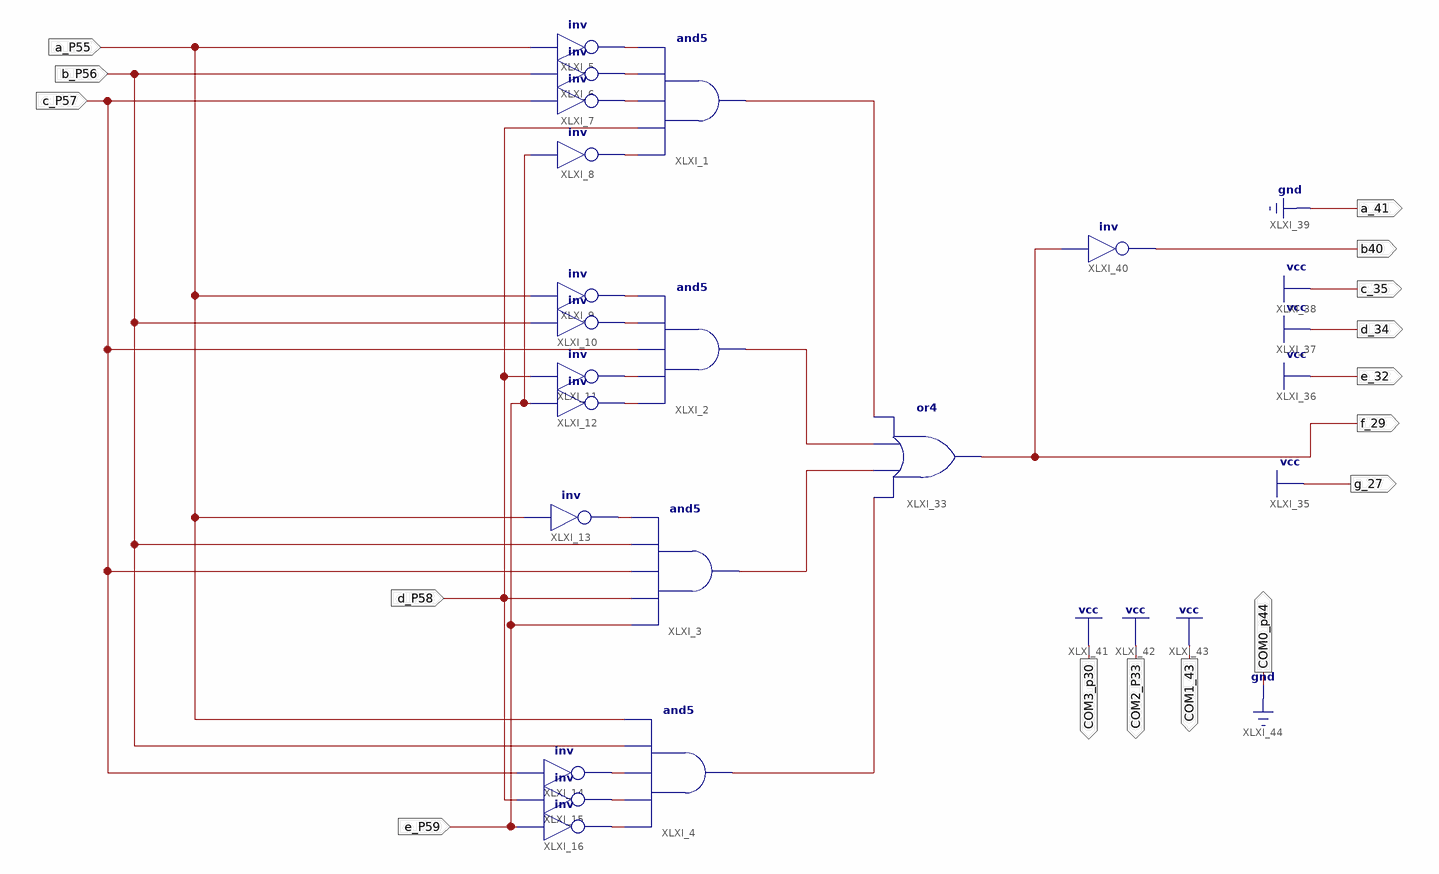
[diagram p0: schematic sheet 1]
// Xilinx ISE schematic weather.sch (spartan6) as structural Verilog: 18 symbols, 16 ports
module weather (
  input  a_P55,
  input  b_P56,
  input  c_P57,
  input  d_P58,
  input  e_P59,
  output a_41,
  output b40,
  output c_35,
  output d_34,
  output e_32,
  output f_29,
  output g_27,
  output COM3_p30,
  output COM2_P33,
  output COM1_43,
  output COM0_p44
);

  wire XLXN_1, XLXN_2, XLXN_3, XLXN_4, XLXN_5, XLXN_6, XLXN_7, XLXN_8, XLXN_9, XLXN_10, XLXN_11, XLXN_12,
       XLXN_45, XLXN_46, XLXN_47, XLXN_48;

  and XLXI_2 (XLXN_46, XLXN_8, XLXN_7, c_P57, XLXN_6, XLXN_5);
  and XLXI_3 (XLXN_47, e_P59, d_P58, c_P57, b_P56, XLXN_9);
  and XLXI_4 (XLXN_48, XLXN_12, XLXN_11, XLXN_10, b_P56, a_P55);
  not XLXI_9 (XLXN_5, a_P55);
  not XLXI_10 (XLXN_6, b_P56);
  not XLXI_11 (XLXN_7, d_P58);
  not XLXI_12 (XLXN_8, e_P59);
  not XLXI_13 (XLXN_9, a_P55);
  not XLXI_14 (XLXN_10, c_P57);
  not XLXI_15 (XLXN_11, d_P58);
  not XLXI_16 (XLXN_12, e_P59);
  and XLXI_1 (XLXN_45, XLXN_4, d_P58, XLXN_3, XLXN_2, XLXN_1);
  not XLXI_5 (XLXN_1, a_P55);
  not XLXI_6 (XLXN_2, b_P56);
  not XLXI_7 (XLXN_3, c_P57);
  not XLXI_8 (XLXN_4, e_P59);
  or XLXI_33 (f_29, XLXN_48, XLXN_47, XLXN_46, XLXN_45);
  not XLXI_40 (b40, f_29);

  assign a_41 = 1'b0;
  assign c_35 = 1'b1;
  assign COM0_p44 = 1'b0;
  assign COM1_43 = 1'b1;
  assign COM2_P33 = 1'b1;
  assign COM3_p30 = 1'b1;
  assign d_34 = 1'b1;
  assign e_32 = 1'b1;
  assign g_27 = 1'b1;
endmodule
